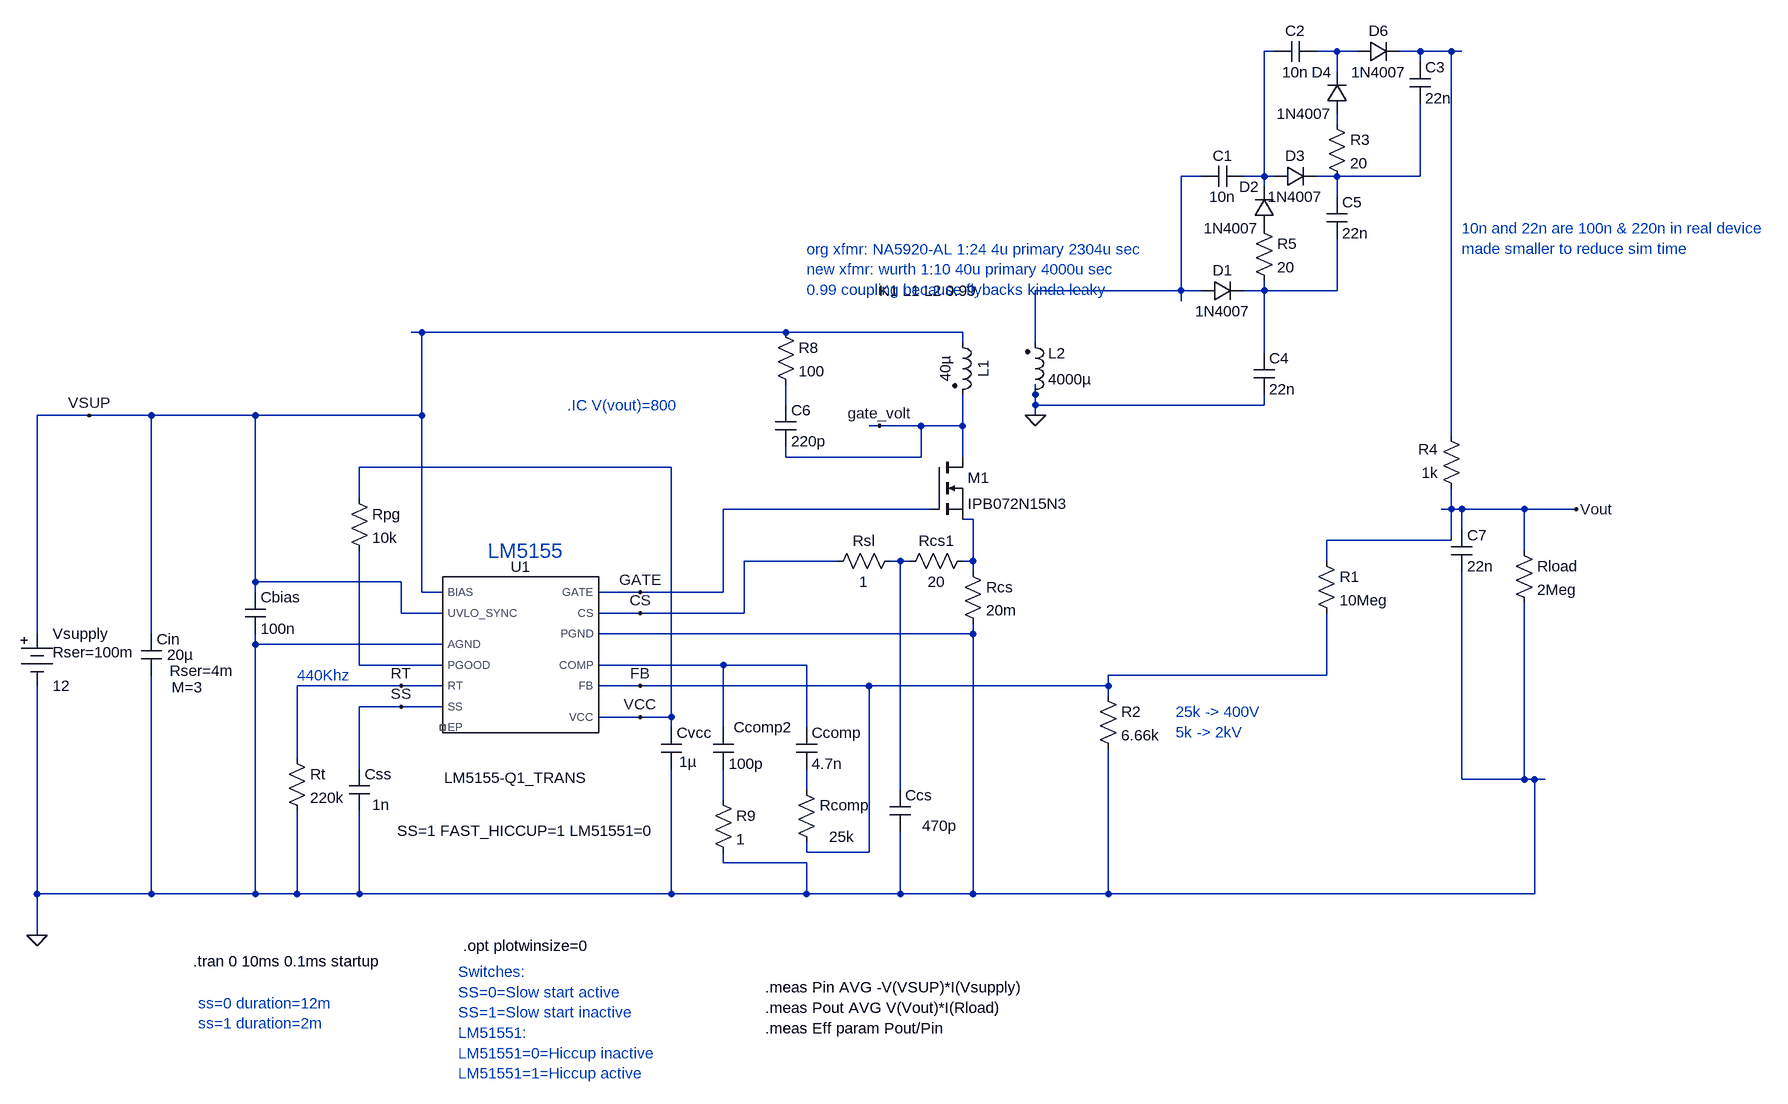
[diagram p0: schematic Current_PSU.asc]
Current_PSU.asc, the LTspice schematic file:
Version 4
SHEET 1 1968 6380
WIRE 48 -1504 32 -1504
WIRE 144 -1504 112 -1504
WIRE 176 -1504 144 -1504
WIRE 272 -1504 240 -1504
WIRE 320 -1504 272 -1504
WIRE 336 -1504 320 -1504
WIRE 272 -1488 272 -1504
WIRE 144 -1472 144 -1504
WIRE 144 -1392 144 -1408
WIRE -64 -1312 -96 -1312
WIRE 32 -1312 32 -1504
WIRE 32 -1312 0 -1312
WIRE 48 -1312 32 -1312
WIRE 144 -1312 112 -1312
WIRE 272 -1312 272 -1424
WIRE 272 -1312 144 -1312
WIRE 32 -1296 32 -1312
WIRE 144 -1280 144 -1312
WIRE -96 -1136 -96 -1312
WIRE -96 -1136 -320 -1136
WIRE -64 -1136 -96 -1136
WIRE 32 -1136 32 -1152
WIRE 32 -1136 0 -1136
WIRE 144 -1136 144 -1216
WIRE 144 -1136 32 -1136
WIRE -96 -1120 -96 -1136
WIRE -1264 -1072 -1280 -1072
WIRE -704 -1072 -1264 -1072
WIRE -432 -1072 -704 -1072
WIRE -432 -1056 -432 -1072
WIRE -320 -1056 -320 -1136
WIRE 32 -1040 32 -1136
WIRE -320 -976 -320 -992
WIRE -704 -960 -704 -992
WIRE -320 -960 -320 -976
WIRE 32 -960 32 -976
WIRE 32 -960 -320 -960
WIRE -1776 -944 -1856 -944
WIRE -1680 -944 -1776 -944
WIRE -1520 -944 -1680 -944
WIRE -1264 -944 -1264 -1072
WIRE -1264 -944 -1520 -944
WIRE -320 -944 -320 -960
WIRE -560 -928 -576 -928
WIRE -496 -928 -560 -928
WIRE -432 -928 -432 -976
WIRE -432 -928 -496 -928
WIRE 320 -912 320 -1504
WIRE -704 -880 -704 -896
WIRE -496 -880 -496 -928
WIRE -496 -880 -704 -880
WIRE -432 -880 -432 -928
WIRE -880 -864 -1360 -864
WIRE -1360 -816 -1360 -864
WIRE -480 -800 -800 -800
WIRE 320 -800 320 -832
WIRE 320 -800 304 -800
WIRE 336 -800 320 -800
WIRE 432 -800 336 -800
WIRE 512 -800 432 -800
WIRE -416 -784 -432 -784
WIRE 336 -768 336 -800
WIRE 320 -752 320 -800
WIRE 320 -752 128 -752
WIRE 432 -736 432 -800
WIRE -624 -720 -768 -720
WIRE -528 -720 -544 -720
WIRE -512 -720 -528 -720
WIRE -416 -720 -416 -784
WIRE -416 -720 -432 -720
WIRE 128 -720 128 -752
WIRE -416 -704 -416 -720
WIRE -1520 -688 -1520 -944
WIRE -1296 -688 -1520 -688
WIRE -1520 -672 -1520 -688
WIRE -1264 -672 -1264 -944
WIRE -1232 -672 -1264 -672
WIRE -928 -672 -992 -672
WIRE -800 -672 -800 -800
WIRE -800 -672 -928 -672
WIRE -1296 -640 -1296 -688
WIRE -1232 -640 -1296 -640
WIRE -928 -640 -992 -640
WIRE -768 -640 -768 -720
WIRE -768 -640 -928 -640
WIRE -1856 -608 -1856 -944
WIRE -1680 -608 -1680 -944
WIRE -416 -608 -416 -624
WIRE -416 -608 -992 -608
WIRE -1520 -592 -1520 -608
WIRE -1232 -592 -1520 -592
WIRE -1360 -560 -1360 -736
WIRE -1232 -560 -1360 -560
WIRE -800 -560 -992 -560
WIRE -672 -560 -800 -560
WIRE 128 -544 128 -640
WIRE 128 -544 -208 -544
WIRE -1296 -528 -1456 -528
WIRE -1232 -528 -1296 -528
WIRE -928 -528 -992 -528
WIRE -576 -528 -928 -528
WIRE -208 -528 -208 -544
WIRE -208 -528 -576 -528
WIRE -208 -512 -208 -528
WIRE -1296 -496 -1360 -496
WIRE -1232 -496 -1296 -496
WIRE -928 -480 -992 -480
WIRE -880 -480 -880 -864
WIRE -880 -480 -928 -480
WIRE -880 -464 -880 -480
WIRE -800 -464 -800 -560
WIRE -672 -464 -672 -560
WIRE -1456 -416 -1456 -528
WIRE -1360 -400 -1360 -496
WIRE 336 -384 336 -704
WIRE 432 -384 432 -656
WIRE 432 -384 336 -384
WIRE 448 -384 432 -384
WIRE 464 -384 448 -384
WIRE -672 -368 -672 -400
WIRE -528 -368 -528 -720
WIRE -800 -352 -800 -400
WIRE -672 -272 -672 -288
WIRE -576 -272 -576 -528
WIRE -576 -272 -672 -272
WIRE -800 -256 -800 -272
WIRE -672 -256 -800 -256
WIRE -1856 -208 -1856 -528
WIRE -1680 -208 -1680 -544
WIRE -1680 -208 -1856 -208
WIRE -1520 -208 -1520 -592
WIRE -1520 -208 -1680 -208
WIRE -1456 -208 -1456 -336
WIRE -1456 -208 -1520 -208
WIRE -1360 -208 -1360 -336
WIRE -1360 -208 -1456 -208
WIRE -880 -208 -880 -400
WIRE -880 -208 -1360 -208
WIRE -672 -208 -672 -256
WIRE -672 -208 -880 -208
WIRE -528 -208 -528 -304
WIRE -528 -208 -672 -208
WIRE -416 -208 -416 -608
WIRE -416 -208 -528 -208
WIRE -208 -208 -208 -432
WIRE -208 -208 -416 -208
WIRE 448 -208 448 -384
WIRE 448 -208 -208 -208
WIRE -1856 -144 -1856 -208
FLAG -1856 -144 0
FLAG 512 -800 Vout
FLAG -928 -672 GATE
FLAG -1296 -496 SS
FLAG -1296 -528 RT
FLAG -928 -528 FB
FLAG -928 -640 CS
FLAG -928 -480 VCC
FLAG -1776 -944 VSUP
FLAG -560 -928 gate_volt
FLAG -320 -944 0
SYMBOL nmos -480 -880 R0
SYMATTR InstName M1
SYMATTR Value IPB072N15N3
SYMBOL ind2 -448 -1072 R0
WINDOW 0 32 56 VTop 2
WINDOW 3 5 56 VBottom 2
WINDOW 39 -45 65 VTop 2
SYMATTR InstName L1
SYMATTR Value 40µ
SYMATTR Type ind
SYMBOL res -1376 -832 R0
SYMATTR InstName Rpg
SYMATTR Value 10k
SYMBOL cap -1376 -400 R0
WINDOW 3 36 55 Left 2
WINDOW 123 50 83 Left 2
SYMATTR Value 1n
SYMATTR InstName Css
SYMATTR SpiceLine V=25 Irms=949m Rser=0.087237 Lser=0 mfg="   ---" pn="   ---" type="   ---"
SYMBOL res -1472 -432 R0
SYMATTR InstName Rt
SYMATTR Value 220k
SYMBOL res -688 -384 R0
WINDOW 3 51 88 Left 2
SYMATTR Value 25k
SYMATTR InstName Rcomp
SYMBOL cap -688 -464 R0
SYMATTR InstName Ccomp
SYMATTR Value 4.7n
SYMATTR SpiceLine Rser=1m
SYMBOL cap -816 -464 R0
WINDOW 0 32 0 Left 2
SYMATTR InstName Ccomp2
SYMATTR Value 100p
SYMATTR SpiceLine Rser=1m
SYMBOL res -432 -720 R0
SYMATTR InstName Rcs
SYMATTR Value 20m
SYMBOL cap -1696 -608 R0
WINDOW 3 40 32 Left 2
WINDOW 39 44 57 Left 2
WINDOW 40 47 82 Left 2
SYMATTR Value 20µ
SYMATTR SpiceLine Rser=4m
SYMATTR SpiceLine2 M=3
SYMATTR InstName Cin
SYMBOL res -416 -736 R90
WINDOW 0 0 56 VBottom 2
WINDOW 3 32 56 VTop 2
SYMATTR InstName Rcs1
SYMATTR Value 20
SYMBOL LM5155-Q1_TRANS -1120 -576 R0
WINDOW 39 16 255 Top 2
SYMATTR SpiceLine SS=1 FAST_HICCUP=1 LM51551=0
SYMATTR InstName U1
SYMBOL cap -1536 -672 R0
SYMATTR InstName Cbias
SYMATTR Value 100n
SYMBOL cap -544 -368 R0
WINDOW 3 50 55 Left 2
WINDOW 123 50 83 Left 2
SYMATTR Value 470p
SYMATTR InstName Ccs
SYMATTR SpiceLine V=25 Irms=949m mfg="   ---" pn="   ---" type="   ---"
SYMBOL res -528 -736 R90
WINDOW 0 0 56 VBottom 2
WINDOW 3 32 56 VTop 2
SYMATTR InstName Rsl
SYMATTR Value 1
SYMBOL cap -896 -464 R0
WINDOW 3 28 53 Left 2
WINDOW 123 50 83 Left 2
SYMATTR Value 1µ
SYMATTR InstName Cvcc
SYMATTR SpiceLine V=25 Irms=949m Rser=15m Lser=0
SYMBOL battery -1856 -624 R0
WINDOW 123 0 0 Left 0
WINDOW 39 24 44 Left 2
SYMATTR SpiceLine Rser=100m
SYMATTR InstName Vsupply
SYMATTR Value 12
SYMBOL ind2 -336 -960 M180
WINDOW 0 36 80 Left 2
WINDOW 3 36 40 Left 2
SYMATTR InstName L2
SYMATTR Value 4000µ
SYMATTR Type ind
SYMATTR SpiceLine Rser=5.15
SYMBOL Res 112 -736 R0
SYMATTR InstName R1
SYMATTR Value 10Meg
SYMBOL Res 336 -816 R180
WINDOW 0 36 76 Left 2
WINDOW 3 36 40 Left 2
SYMATTR InstName R4
SYMATTR Value 1k
SYMBOL Cap 320 -768 R0
SYMATTR InstName C7
SYMATTR Value 22n
SYMBOL Res -224 -528 R0
SYMATTR InstName R2
SYMATTR Value 6.66k
SYMBOL diode -64 -1120 R270
WINDOW 0 32 32 VTop 2
WINDOW 3 0 32 VBottom 2
SYMATTR InstName D1
SYMATTR Value 1N4007
SYMBOL Cap 0 -1328 R90
WINDOW 0 0 32 VBottom 2
WINDOW 3 32 32 VTop 2
SYMATTR InstName C1
SYMATTR Value 10n
SYMBOL diode 48 -1232 R180
WINDOW 0 24 64 Left 2
WINDOW 3 24 0 Left 2
SYMATTR InstName D2
SYMATTR Value 1N4007
SYMBOL diode 48 -1296 R270
WINDOW 0 32 32 VTop 2
WINDOW 3 0 32 VBottom 2
SYMATTR InstName D3
SYMATTR Value 1N4007
SYMBOL diode 160 -1408 R180
WINDOW 0 24 64 Left 2
WINDOW 3 24 0 Left 2
SYMATTR InstName D4
SYMATTR Value 1N4007
SYMBOL diode 176 -1488 R270
WINDOW 0 32 32 VTop 2
WINDOW 3 0 32 VBottom 2
SYMATTR InstName D6
SYMATTR Value 1N4007
SYMBOL Cap 48 -1488 R270
WINDOW 0 32 32 VTop 2
WINDOW 3 0 32 VBottom 2
SYMATTR InstName C2
SYMATTR Value 10n
SYMBOL Cap 256 -1488 R0
SYMATTR InstName C3
SYMATTR Value 22n
SYMBOL Cap 16 -1040 R0
SYMATTR InstName C4
SYMATTR Value 22n
SYMBOL Cap 128 -1280 R0
SYMATTR InstName C5
SYMATTR Value 22n
SYMBOL Res 128 -1408 R0
SYMATTR InstName R3
SYMATTR Value 20
SYMBOL Res 16 -1248 R0
SYMATTR InstName R5
SYMATTR Value 20
SYMBOL Res 416 -752 R0
SYMATTR InstName Rload
SYMATTR Value 2Meg
SYMBOL Res -720 -1088 R0
SYMATTR InstName R8
SYMATTR Value 100
SYMBOL Cap -720 -960 R0
SYMATTR InstName C6
SYMATTR Value 220p
SYMBOL Res -816 -368 R0
SYMATTR InstName R9
SYMATTR Value 1
TEXT -1616 -104 Left 2 !.tran 0 10ms 0.1ms startup
TEXT -1040 -960 Left 2 ;.IC V(vout)=800
TEXT -1200 -128 Left 2 !.opt plotwinsize=0
TEXT -1456 -544 Left 2 ;440Khz
TEXT -1608 -40 Left 2 ;ss=0 duration=12m\nss=1 duration=2m
TEXT -1104 -736 Center 3 ;LM5155
TEXT -1208 -88 Left 2 ;Switches:\nSS=0=Slow start active\nSS=1=Slow start inactive\nLM51551:\nLM51551=0=Hiccup inactive\nLM51551=1=Hiccup active
TEXT -736 -64 Left 2 !.meas Pin AVG -V(VSUP)*I(Vsupply)\n.meas Pout AVG V(Vout)*I(Rload)\n.meas Eff param Pout/Pin
TEXT -560 -1136 Left 2 !K1 L1 L2 0.99
TEXT -104 -488 Left 2 ;25k -> 400V\n5k -> 2kV
TEXT -672 -1200 Left 2 ;org xfmr: NA5920-AL 1:24 4u primary 2304u sec\nnew xfmr: wurth 1:10 40u primary 4000u sec\n0.99 coupling because flybacks kinda leaky
TEXT 336 -1232 Left 2 ;10n and 22n are 100n & 220n in real device\nmade smaller to reduce sim time

The netlist it stands for:
* Current_PSU.asc
M1 gate_volt GATE N009 N009 IPB072N15N3
L1 VSUP gate_volt 40µ
Rpg VCC N011 10k
Css SS 0 1n V=25 Irms=949m Rser=0.087237 Lser=0 mfg="   ---" pn="   ---" type="   ---"
Rt RT 0 220k
Rcomp N013 FB 25k
Ccomp N012 N013 4.7n Rser=1m
Ccomp2 N012 N014 100p Rser=1m
Rcs N009 0 20m
Cin VSUP 0 20µ Rser=4m M=3
Rcs1 N009 N010 20
XU1 0 VSUP N012 CS NC_01 FB GATE 0 N011 RT SS VSUP VCC LM5155-Q1_TRANS SS=1 FAST_HICCUP=1 LM51551=0  ; pins AGND BIAS COMP CS EP FB GATE PGND PGOOD RT SS UVLO_SYNC VCC
Cbias VSUP 0 100n
Ccs N010 0 470p V=25 Irms=949m mfg="   ---" pn="   ---" type="   ---"
Rsl N010 CS 1
Cvcc VCC 0 1µ V=25 Irms=949m Rser=15m Lser=0
Vsupply VSUP 0 12 Rser=100m
L2 0 N005 4000µ Rser=5.15
R1 Vout FB 10Meg
R4 Vout N003 1k
C7 Vout 0 22n
R2 FB 0 6.66k
D1 N005 N007 1N4007
C1 N001 N005 10n
D2 P001 N001 1N4007
D3 N001 N006 1N4007
D4 N004 N002 1N4007
D6 N002 N003 1N4007
C2 N001 N002 10n
C3 N003 N006 22n
C4 N007 0 22n
C5 N006 N007 22n
R3 N004 N006 20
R5 P001 N007 20
Rload Vout 0 2Meg
R8 VSUP N008 100
C6 N008 gate_volt 220p
R9 N014 0 1
.model D D
.lib standard.dio
.model NMOS NMOS
.model PMOS PMOS
.lib standard.mos
.tran 0 10ms 0.1ms startup
* .IC V(vout)=800
.opt plotwinsize=0
* 440Khz
* ss=0 duration=12m
* ss=1 duration=2m
* LM5155
* Switches:
* SS=0=Slow start active
* SS=1=Slow start inactive
* LM51551:
* LM51551=0=Hiccup inactive
* LM51551=1=Hiccup active
.meas Pin AVG -V(VSUP)*I(Vsupply)
.meas Pout AVG V(Vout)*I(Rload)
.meas Eff param Pout/Pin
K1 L1 L2 0.99
* 25k -> 400V
* 5k -> 2kV
* org xfmr: NA5920-AL 1:24 4u primary 2304u sec
* new xfmr: wurth 1:10 40u primary 4000u sec
* 0.99 coupling because flybacks kinda leaky
* 10n and 22n are 100n & 220n in real device
* made smaller to reduce sim time
.lib LM5155-Q1_TRANS_LTspice.lib
.backanno
.end